# Altium schematic sheet Sheet1.SchDoc
size B
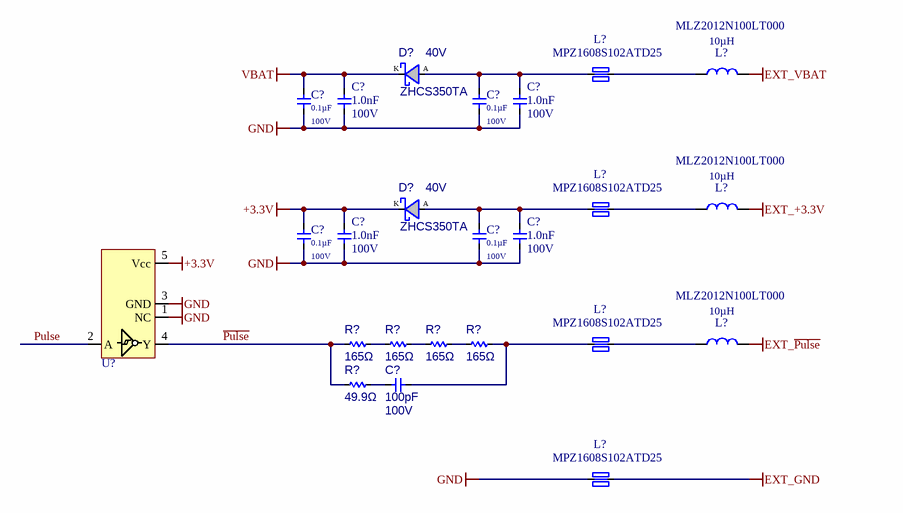
[diagram p0: Sheet1.SchDoc]

## Parts
(Parts that share a designator on the sheet are numbered #1, #2 ... from top to bottom, then left to right.)
C?#1  Capacitance: 0.1µF  Rating - Voltage: 100V  [CAP0603_H35]  (hidden comment: ST00000252)
C?#2  Capacitance: 1.0nF  Rating - Voltage: 100V  [CAP0402_H20]  (hidden comment: ST00000324)
C?#3  Capacitance: 0.1µF  Rating - Voltage: 100V  [CAP0603_H35]  (hidden comment: ST00000252)
C?#4  Capacitance: 1.0nF  Rating - Voltage: 100V  [CAP0402_H20]  (hidden comment: ST00000324)
C?#5  Capacitance: 0.1µF  Rating - Voltage: 100V  [CAP0603_H35]  (hidden comment: ST00000252)
C?#6  Capacitance: 1.0nF  Rating - Voltage: 100V  [CAP0402_H20]  (hidden comment: ST00000324)
C?#7  Capacitance: 0.1µF  Rating - Voltage: 100V  [CAP0603_H35]  (hidden comment: ST00000252)
C?#8  Capacitance: 1.0nF  Rating - Voltage: 100V  [CAP0402_H20]  (hidden comment: ST00000324)
C?#9  Capacitance: 100pF  Rating - Voltage: 100V  [CAP0603_H32]  (hidden comment: ST00000464)
D?#1  Manufacturer Part Number: ZHCS350TA  Rating - Voltage (reverse): 40V  [SOD-523_DIO_DI]  (hidden comment: ST00000124)
D?#2  Manufacturer Part Number: ZHCS350TA  Rating - Voltage (reverse): 40V  [SOD-523_DIO_DI]  (hidden comment: ST00000124)
L?#1  Manufacturer Part Number: MPZ1608S102ATD25  [FB0603_H37]  (hidden comment: ST00000635)
L?#2  Inductance: 10µH  Manufacturer Part Number: MLZ2012N100LT000  [IND0805_H57]  (hidden comment: ST00000189)
L?#3  Manufacturer Part Number: MPZ1608S102ATD25  [FB0603_H37]  (hidden comment: ST00000635)
L?#4  Inductance: 10µH  Manufacturer Part Number: MLZ2012N100LT000  [IND0805_H57]  (hidden comment: ST00000189)
L?#5  Manufacturer Part Number: MPZ1608S102ATD25  [FB0603_H37]  (hidden comment: ST00000635)
L?#6  Inductance: 10µH  Manufacturer Part Number: MLZ2012N100LT000  [IND0805_H57]  (hidden comment: ST00000189)
L?#7  Manufacturer Part Number: MPZ1608S102ATD25  [FB0603_H37]  (hidden comment: ST00000635)
R?#1  Resistance: 165Ω  [RES0603_H22]  (hidden comment: ST00000382)
R?#2  Resistance: 165Ω  [RES0603_H22]  (hidden comment: ST00000382)
R?#3  Resistance: 165Ω  [RES0603_H22]  (hidden comment: ST00000382)
R?#4  Resistance: 165Ω  [RES0603_H22]  (hidden comment: ST00000382)
R?#5  Resistance: 49.9Ω  [RES0603_H22]  (hidden comment: ST00000392)
U?  SN74LVC1G14DCKR  [SOT-363-5]  (value not drawn)

## Nets
+3.3V: C?#5.1 C?#6.1 D?#2.K U?.5(Vcc)
EXT_+3.3V: L?#4.2(N2)
EXT_GND: L?#7.2
EXT_~{Pulse}: L?#6.2(N2)
EXT_VBAT: L?#2.2(N2)
GND: C?#1.2 C?#2.2 C?#3.2 C?#4.2 C?#5.2 C?#6.2 C?#7.2 C?#8.2 L?#7.1 U?.1(NC) U?.3(GND)
VBAT: C?#1.1 C?#2.1 D?#1.K
~{Pulse}: R?#1.1 R?#5.1 U?.4(Y)
Pulse: U?.2(A)
NetC?#3_1: C?#3.1 C?#4.1 D?#1.A L?#1.1
NetC?#7_1: C?#7.1 C?#8.1 D?#2.A L?#3.1
NetC?#9_1: C?#9.1 R?#5.2
NetC?#9_2: C?#9.2 L?#5.1 R?#4.2
NetL?#1_2: L?#1.2 L?#2.1(N1)
NetL?#3_2: L?#3.2 L?#4.1(N1)
NetL?#5_2: L?#5.2 L?#6.1(N1)
NetR?#1_2: R?#1.2 R?#2.1
NetR?#2_2: R?#2.2 R?#3.1
NetR?#3_2: R?#3.2 R?#4.1

## Library data of the parts
C?#1 C?#3 C?#5 C?#7 = HVOR_OST_CAP-00047-10: CAP, CERAMIC, X7R, 0.1UF, 10%, 100V, ROHS, 0603, AECQ200; Legacy OST Part Number: 06-000805; Manufacturer Part Number: GCJ188R72A104KA01D; Manufacturer: MURATA; Tolerance Negative (%): -10%; Qualification: AEC-Q200; Type: Class 2; Tolerance Positive (%): +10%; Capacitance (Raw): 0.0000001; Medini: Yes; Tolerance: ±10%; ComponentLink1Description: !Datasheet; ComponentLink1URL: https://www.murata.com/-/media/webrenewal/support/library/catalog/products/k35e.ashx?la=en-us&cvid=20200508021757000000; RoHS Compliant: Yes; Part Number: ST00000252; ComponentLink2URL: https://www.digikey.com/en/products/detail/murata-electronics/GCJ188R72A104KA01D/6012274?s=N4IgTCBcDaIOIGEBSBGAHGgSgdjAQRQAYAWAaT0JQBEQBdAXyA; Package / Case: 0603 (1608 Metric); Operating Temp (min) (°C): -55°C; Automotive Approved: Yes; Lead Free: No; ComponentLink2Description: !Vendor Website; Operating Temp (max) (°C): +125°C; Part Type: Electronic - Capacitors; Agile: Yes; Applications: Automotive
C?#2 C?#4 C?#6 C?#8 = HVOR_OST_CAP-00023-12: CAP, CERAMIC, X7R, 1NF, 10%, 100V, ROHS, 0402, AECQ200; Manufacturer Part Number: GCM155R72A102KA37D; Manufacturer: MURATA; Legacy OST Part Number: 06-000036; Agile: Yes; Medini: No; Capacitance (Raw): 0.000000001; Tolerance Positive (%): +10%; Tolerance Negative (%): -10%; Qualification: AEC-Q200; Type: Class 2; Tolerance: ±10%; ComponentLink2URL: https://www.digikey.com/en/products/detail/murata-electronics/GCM155R72A102KA37D/1641638?s=N4IgTCBcDaIOIGECyBGArGgSgdjAQRQAYwBpPAZmwBEQBdAXyA; Part Number: ST00000324; Operating Temp (max) (°C): +125°C; Automotive Approved: Yes; RoHS Compliant: Yes; Operating Temp (min) (°C): -55°C; Part Type: Electronic - Capacitors; REACH Compliant: Yes; Lead Free: No; Package / Case: 0402 (1005 Metric); ComponentLink1URL: https://www.murata.com/-/media/webrenewal/support/library/catalog/products/k35e.ashx?la=en-us&cvid=20200508021757000000; ComponentLink2Description: !Vendor Website; Halogen Free: No; Applications: Automotive; ComponentLink1Description: !Datasheet
C?#9 = HVOR_OST_CAP-00084-10: CAP, CERAMIC, C0G, 100PF, 5%, 100V, ROHS, 0603; Legacy OST Part Number: 06-000035; Manufacturer Part Number: GRM1885C2A101JA01D; Manufacturer: MURATA; Agile: Yes; Tolerance Positive (%): +5%; Automotive Approved: No; Tolerance Negative (%): -5%; Capacitance (Raw): 0.000000000100; Type: Class 1; Part Type: Electronic - Capacitors; ComponentLink2Description: !Vendor Website; Part Number: ST00000464; Lead Free: No; RoHS Compliant: Yes; Medini: No; ComponentLink1Description: !Datasheet; ComponentLink2URL: https://www.digikey.com/en/products/detail/murata-electronics/GRM1885C2A101JA01D/586979?s=N4IgTCBcDaIOICUCyBGAHGgrAYTAQRQAYUApPYgERAF0BfIA; REACH Compliant: Yes; Halogen Free: No; Operating Temp (min) (°C): -55°C; ComponentLink1URL: https://search.murata.co.jp/Ceramy/image/img/A01X/G101/ENG/GRM1885C2A101JA01-01.pdf; Operating Temp (max) (°C): +125°C; Package / Case: 0603 (1608 Metric); Applications: General Purpose
D?#1 D?#2 = HVOR_OST_DIO-00002-14: DIO, SCHOTTKY, 40V, 0.35A, ROHS, SOD523; Manufacturer: DIODES INC; Legacy OST Part Number: 12-000041; Rating - Current (forward): 350mA; Rating - Power: 285mW; Rating - Voltage (forward, max): 810mV @350mA; Rating - Current (reverse leakage): 0.012mA @30V; Reverse Recovery Time: 1.6ns; Speed: <500ns, >200mA; Capacitance: 6pF @25V, 1MHz; Agile: Yes; Automotive Approved: No; Package / Case: SC-79, SOD-523; Type: Schottky; ComponentLink1Description: !Datasheet; ComponentLink1URL: https://www.diodes.com/assets/Datasheets/ZHCS350.pdf; ComponentLink2Description: !Vendor Website; ComponentLink2URL: https://www.digikey.com/en/products/detail/diodes-incorporated/ZHCS350TA/991137?s=N4IgTCBcDaIFoAkDCBlAzAVgAwBUCCIAugL5A; Operating Temp (min) (°C): -55°C; Operating Temp (max) (°C): +125°C; RoHS Compliant: Yes; Lead Free: Yes; Storage Temp (min) (°C): -55°C; Medini: Yes; Applications: General Purpose; Storage Temp (max) (°C): +150°C; Part Number: ST00000124; Part Type: Electronic - Diodes; Supplier Device Package: SOD-523
L?#1 L?#3 L?#5 L?#7 = HVOR_OST_IND-00041-5: IND, FERRITE BEAD, 1K OHM, 25%, 0.8A, 0.3 OHM, ROHS, 0603, AECQ200; Manufacturer: TDK/EPCOS; Resistance (DC): 300mΩ DCR; Impedance: 1kΩ; Impedance (raw): 1000; Agile: Yes; Number of Lines: 1; Shielding: Shielded; Medini: No; Qualification: AEC-Q200; ComponentLink1Description: !Datasheet; ComponentLink1URL: https://product.tdk.com/en/system/files?file=dam/doc/product/emc/emc/beads/catalog/beads_automotive_power_mpz1608_en.pdf; ComponentLink2Description: !Vendor Website; ComponentLink2URL: https://www.digikey.com/en/products/detail/tdk-corporation/MPZ1608S102ATD25/5040313?s=N4IgTCBcDaILIAUBaBGAbABgBwGUUbAEEAVAETAFYQBdAXyA; Rating - Current: 0.8A; Tolerance: ±25%; RoHS Compliant: Yes; Operating Temp (min) (°C): -55°C; Operating Temp (max) (°C): +125°C; Package / Case: 0603 (1608 Metric); Dimension (L x W): 1.6 x 0.8mm; Dimension (H): 0.037" (0.95mm); Lead Free: Yes; Part Number: ST00000635; REACH Compliant: Yes; Storage Temp (min) (°C): -55°C; Moisture Level (MSD) (1 - 6): 1; Halogen Free: Yes; Storage Temp (max) (°C): +125°C; Core Material: Ferrite; Automotive Approved: Yes
L?#2 L?#4 L?#6 = HVOR_OST_IND-00000-9: IND, 10UH, 20%, 0.5A, 0.3 OHM, ROHS, 0805; Manufacturer: TDK/EPCOS; Automotive Approved: No; Rating - Current: 500mA; Inductance (Raw): 0.000010; Shielding: Shielded; Type (filter): Multilayer; Frequency (self-resonant): 50MHz; Core Material: Ferrite; Resistance (DC): 300mΩ DCR; Agile: Yes; Number of Lines: 1; Qualification: General Purpose; Operating Temp (min) (°C): -55°C; Medini: No; Package / Case: 0805 (2012 Metric); Part type: Electronic - Inductors, Coils, Ferrite Cores, etc; Type: Inductor; Part Number: ST00000189; Lead Free: Yes; ComponentLink2URL: https://www.digikey.com/en/products/detail/tdk-corporation/MLZ2012N100LT000/2523500?s=N4IgTCBcDaILIBkBaYAMBGMA5drUIBU9UQBdAXyA; Dimension (H): 0.057" (1.45mm); ComponentLink2Description: !Vendor Website; Storage Temp (min) (°C): -55°C; ComponentLink1Description: !Datasheet; Tolerance: ±20%; Storage Temp (max) (°C): +125°C; Dimension (L x W): 2.0 x 1.25mm; ComponentLink1URL: https://product.tdk.com/en/system/files?file=dam/doc/product/inductor/inductor/smd/catalog/inductor_commercial_decoupling_mlz2012_en.pdf; Moisture Level (MSD) (1 - 6): 1; Operating Temp (max) (°C): +125°C; RoHS Compliant: Yes
R?#1-R?#4 = HVOR_OST_RES-00040-9: RES, 165, 1%, 0.125W, ROHS, 0603, AECQ200; Manufacturer: KOA; Legacy OST Part Number: 28-003304; Manufacturer Part Number: RK73H1JTTD1650F; Rating - Voltage (operating, max): 75V; Agile: Yes; Medini: No; Rating - Voltage (overload, max): 100V; Qualification: AEC-Q200; Rating - Power: 125mW; Temperature Coefficient: ±100ppm/°C; Resistance (raw): 165; ComponentLink2Description: !Vendor Website; Part Type: Electronic - Resistors; Features: Moisture Resistant; Package / Case: 0603 (1608 Metric); Operating Temp (max) (°C): +155°C; RoHS Compliant: Yes; Moisture Level (MSD) (1 - 6): 1; ComponentLink1URL: https://www.koaspeer.com/pdfs/RK73H.pdf; ComponentLink2URL: https://www.digikey.com/en/products/detail/koa-speer-electronics-inc/RK73H1JTTD1650F/9845302?s=N4IgTCBcDaIEoGkDsBmAEgRgFIBUcBEMA2AVgAYAxEAXQF8g; Dimension (L x W): 1.6 x 0.8mm; Part Number: ST00000382; Dimension (H): 0.022" (0.55mm); Operating Temp (min) (°C): -55°C; Halogen Free: No; ComponentLink1Description: !Datasheet; REACH Compliant: Yes; Lead Free: No; Automotive Approved: Yes; Construction: Thick Film; Tolerance: ±1%
R?#5 = HVOR_OST_RES-00038-9: RES, 49.9, 1%, 0.125W, ROHS, 0603, AECQ200; Manufacturer: KOA; Legacy OST Part Number: 28-002703; Manufacturer Part Number: RK73H1JTTD49R9F; Agile: Yes; Temperature Coefficient: ±100ppm/°C; Resistance (raw): 49.9; Rating - Voltage (overload, max): 100V; Rating - Voltage (operating, max): 75V; Rating - Power: 125mW; Qualification: AEC-Q200; Medini: No; Automotive Approved: Yes; REACH Compliant: Yes; ComponentLink1URL: https://www.koaspeer.com/pdfs/RK73H.pdf; Construction: Thick Film; ComponentLink2URL: https://www.digikey.com/en/products/detail/koa-speer-electronics-inc/RK73H1JTTD49R9F/9844851?s=N4IgTCBcDaIEoGkDsBmAEgRgFIBUcBEAWATjmIDEQBdAXyA; Dimension (L x W): 1.6 x 0.8mm; Part Number: ST00000392; ComponentLink1Description: !Datasheet; ComponentLink2Description: !Vendor Website; Dimension (H): 0.022" (0.55mm); Operating Temp (max) (°C): +155°C; RoHS Compliant: Yes; Features: Moisture Resistant; Package / Case: 0603 (1608 Metric); Lead Free: No; Tolerance: ±1%; Moisture Level (MSD) (1 - 6): 1; Halogen Free: No; Operating Temp (min) (°C): -55°C; Part Type: Electronic - Resistors
U? = HVOR_OST_LOGIC/GATE-00087-3: IC, LOGIC, INVERTER, 1.65~5.5V, 0.032A, LOW 0.39~1.87, HIGH 1.16~3.33V, 5NS, 1CH, SC70(5); Manufacturer: TEXAS INSTRUMENTS; Agile: No; RoHS Compliance: Yes; Manufacturer Part Number: SN74LVC1G14DCKR; Operating Temp (max) (°C): +125°C; Operating Temp (min) (°C): -40°C; Medini: No